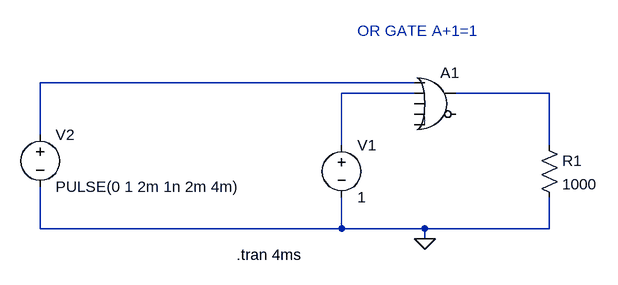
[diagram p0: schematic 4_A_plus_1_equal_1.asc]
4_A_plus_1_equal_1.asc, the LTspice schematic file:
Version 4
SHEET 1 880 680
WIRE 320 112 -256 112
WIRE 320 128 208 128
WIRE 528 128 384 128
WIRE -256 192 -256 112
WIRE 208 208 208 128
WIRE 528 208 528 128
WIRE -256 336 -256 272
WIRE 208 336 208 288
WIRE 208 336 -256 336
WIRE 336 336 208 336
WIRE 528 336 528 288
WIRE 528 336 336 336
WIRE 336 352 336 336
FLAG 336 352 0
SYMBOL Digital\\or 352 80 R0
SYMATTR InstName A1
SYMBOL voltage 208 192 R0
SYMATTR InstName V1
SYMATTR Value 1
SYMBOL voltage -256 176 R0
WINDOW 123 0 0 Left 0
WINDOW 39 0 0 Left 0
SYMATTR InstName V2
SYMATTR Value PULSE(0 1 2m 1n 2m 4m)
SYMBOL res 512 192 R0
SYMATTR InstName R1
SYMATTR Value 1000
TEXT 232 32 Left 2 ;OR GATE A+1=1
TEXT 46 376 Left 2 !.tran 4ms

The netlist it stands for:
* 4_A_plus_1_equal_1.asc
A1 N001 N002 0 0 0 0 N003 0 OR
V1 N002 0 1
V2 N001 0 PULSE(0 1 2m 1n 2m 4m)
R1 N003 0 1000
* OR GATE A+1=1
.tran 4ms
.backanno
.end